# Altium project PCB_8Bit_CPU.PrjPcb
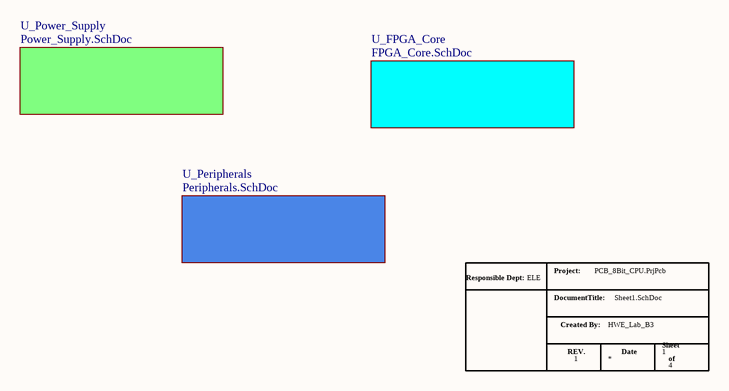
[diagram p0: Sheet1.SchDoc]
4 sheets, 105 parts. Net scope: global (net labels, ports and power ports of the same name join across sheets).
Board file: CPU_Board_Updated.PcbDoc
Sheets:
  Sheet1.SchDoc
    U_Power_Supply = Power_Supply.SchDoc
    U_FPGA_Core = FPGA_Core.SchDoc
    U_Peripherals = Peripherals.SchDoc

## Sheet Sheet1.SchDoc
size A; SheetNumber: 1; SheetTotal: 4

### Parts
(Parts that share a designator on the sheet are numbered #1, #2 ... from top to bottom, then left to right.)
*#1  8Bit_CPU  (value not drawn)  (graphical)

### Sub-sheets
U_FPGA_Core = FPGA_Core.SchDoc: no entries
U_Peripherals = Peripherals.SchDoc: no entries
U_Power_Supply = Power_Supply.SchDoc: no entries

### Notes on the sheet
- (in symbol 8Bit_CPU) Project:; Responsible Dept:; ELE; DocumentTitle:; Created By:; HWE_Lab_B3; Sheet; REV.; Date; 1; of

## Sheet Power_Supply.SchDoc
size A; SheetNumber: 2; SheetTotal: 4
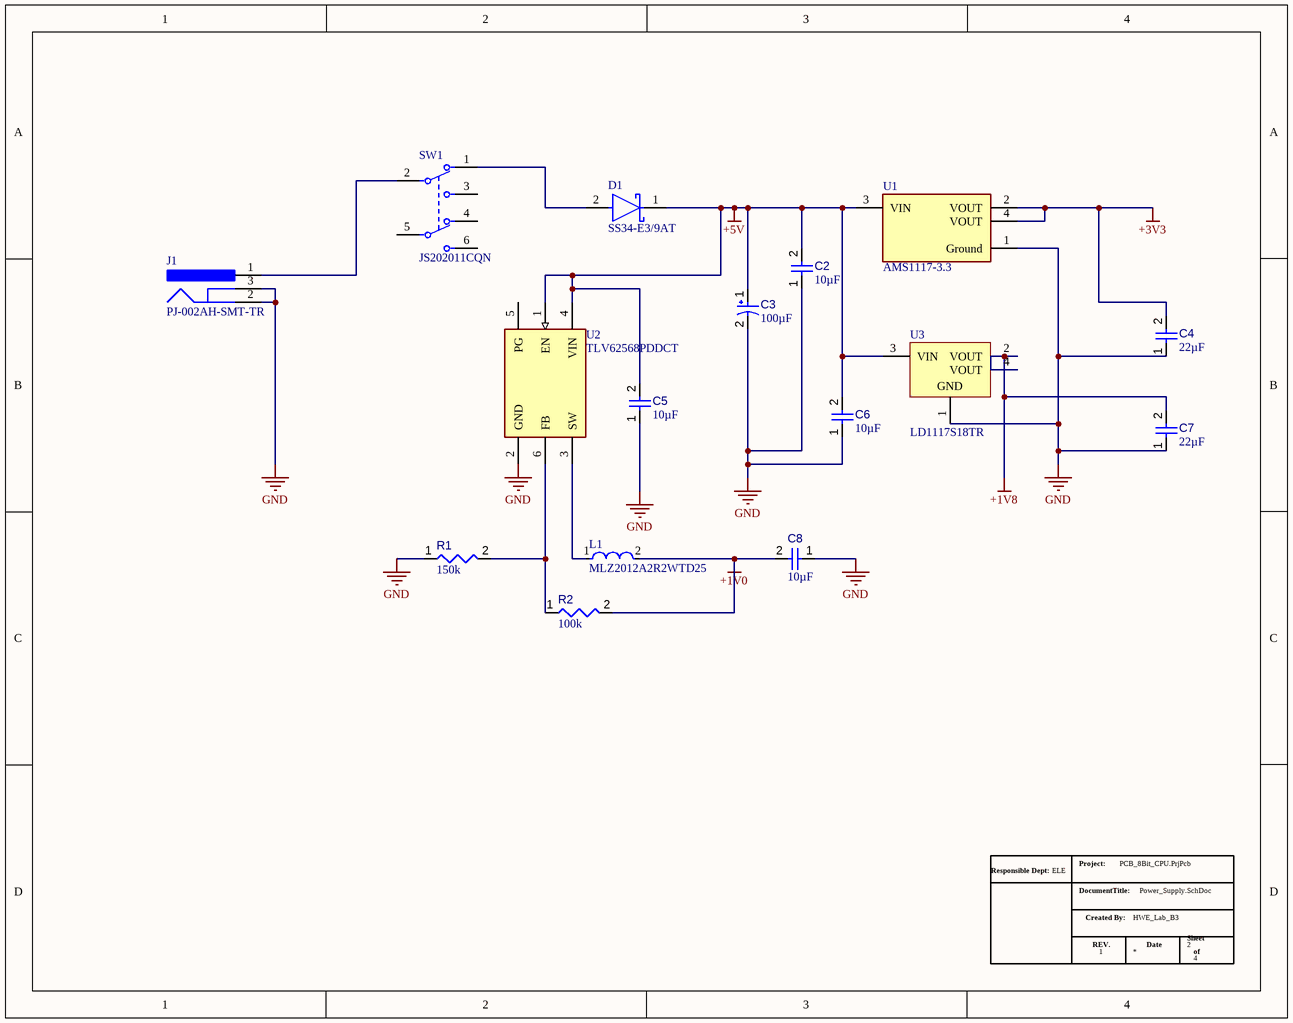
[diagram p1: Power_Supply.SchDoc]

### Parts
(Parts that share a designator on the sheet are numbered #1, #2 ... from top to bottom, then left to right.)
*#2  8Bit_CPU  (value not drawn)  (graphical)
C2  value 10µF  [CAPC0805(2012)145_L]  (hidden comment: Capacitor 10µF +/-20% 25V 0805)
C3  value 100µF  [PNSC-6TPE150MAZB_L]  (hidden comment: Capacitor 6.8µF +/-20% 35V B2)
C4  value 22µF  [CAPC0805(2012)145_L]  (hidden comment: Capacitor 10µF +/-20% 25V 0805)
C5  value 10µF  [CAPC0805(2012)145_L]  (hidden comment: Capacitor 10µF +/-20% 25V 0805)
C6  value 10µF  [CAPC0805(2012)145_L]  (hidden comment: Capacitor 10µF +/-20% 25V 0805)
C7  value 22µF  [CAPC0805(2012)145_L]  (hidden comment: Capacitor 10µF +/-20% 25V 0805)
C8  value 10µF  [CAPC0805(2012)145_L]  (hidden comment: Capacitor 10µF +/-20% 25V 0805)
D1  SS34-E3/9AT  [FP-SMC-MFG]
J1  PJ-002AH-SMT-TR  [CUI-PJ-002AH-4_V]
L1  MLZ2012A2R2WTD25  [FP-MLZ2012-0_85-MFG]
R1  value 150k  [RESC0402(1005)_L]  (hidden comment: Resistor 100K +/-1 % 0402 63 mW)
R2  value 100k  [RESC0402(1005)_L]  (hidden comment: Resistor 100K +/-1 % 0402 63 mW)
SW1  JS202011CQN  [FP-JS202011CQN-MFG]
U1  AMS1117-3.3  [FP-AMS1117-IPC_C]
U2  TLV62568PDDCT  [FP-DDC0006A-MFG]
U3  LD1117S18TR  [SOT-223_M]

### Nets
+1V0: C8.2 L1.2 R2.2
+1V8: C7.2 U3.2(VOUT) U3.4(VOUT)
+3V3: C4.2 U1.2(VOUT) U1.4(VOUT)
+5V: C2.2 C3.1 C5.2 C6.2 D1.1(C) U1.3(VIN) U2.1(EN) U2.4(VIN) U3.3(VIN)
GND: C2.1 C3.2 C4.1 C5.1 C6.1 C7.1 C8.1 J1.2 J1.3 R1.1 U1.1(Ground) U2.2(GND) U3.1(GND)
NetD1_2: D1.2(A) SW1.1
NetJ1_1: J1.1 SW1.2
NetL1_1: L1.1 U2.3(SW)
NetR1_2: R1.2 R2.1 U2.6(FB)

Not connected (* = marked no-connect by the designer): SW1 3 4 5 6; U2 5(PG)

### Notes on the sheet
- (in symbol 8Bit_CPU) Project:; Responsible Dept:; ELE; DocumentTitle:; Created By:; HWE_Lab_B3; Sheet; REV.; Date; 1; of

### Library data of the parts
C2 C4-C8 = CMP-001-00079-4: Chip Capacitor, 10µF +/-20%, 25V, 0805, Thickness 1.45 mm; Tolerance: 10%; Max Operating Temperature: 85°C; Case/Package: 0805; Voltage Rating: 25V; Min Operating Temperature: -55°C; Mounting Technology: SMT; Pins: 2
C3 = CMP-001-00059-3: Molded Tantalum Polymer Capacitor, 6.8 uF, +/- 20%, 35 V, -55 to 105 degC, 2-Pin SMD, RoHS, Tape and Reel; Pins: 2; Voltage Rating: 35V; Case/Package: 1210; Tolerance: 20%; Mounting Technology: SMT; Min Operating Temperature: -55°C; Max Operating Temperature: 105°C
D1 = CMP-02539-000066-1: DIODE SCHOTTKY 40V 3A DO214AB; Peak Non-Repetitive Surge Current: 100A; Forward Voltage: 500mV; Element Configuration: Single; Max Reverse Current: 500uA; Case/Package: SMC; Radiation Hardening: No; Series: -; Max Surge Current: 100A; RoHS Compliant: Yes; Min Operating Temperature: -55°C; Average Rectified Current: 3A; Max Reverse Leakage Current: 500uA; Package Quantity: 3500; Max Reverse Voltage (DC): 40V; Forward Current: 3A; Packaging: Tape and Reel; Max Operating Temperature: 125°C; Max Repetitive Reverse Voltage (Vrrm): 40V; Number of Pins: 2; Mount: Surface Mount
J1 = CMP-2000-06896-2: DC Power Jack, Right Angle, -25 to 85 degC, 4-Pin 14.8 x 9 x 11 mm SMD, RoHS, Tape and Reel; Manufacturer: CUIInc.; Brand: CUI; Inside Contact Diameter: 2mm; Voltage Rating: 24V; Insulation Resistance: 100MOhms; Outside Contact Diameter: 6.5mm; Current Rating: 5A; Mounting Angle: Right; Contact Plating: Nickel; Package Description: 4-Pin Surface Mount Device, Body 14.8 x 9 mm, Pitch 6.1 mm; Factory Pack Quantity: 350; Datasheet Version: Rev. 1.03, 11/2012; Operating Temperature Range: -25Cto+85C; Termination Style: SMD/SMT; Product: Jacks; Contact Gender: Male; Product Category: DCPowerConnectors; RoHS: True; Connector Type: DCPowerJack; Packaging: Reel; Contact Material: Brass; Flammability Rating: UL94V-0; Datasheet URL: http://www.cui.com/product/resource/pj-002ah-smt.pdf; Package Reference: PJ-002AH; Manufacturer URL: http://www.cui.com/; PartNumber: PJ-002AH; Mounting Style: SMD/SMT; Mounting Technology: SurfaceMount; Housing Material: Polyamide(PA)
L1 = CMP-08253-000205-1: Shielded Multilayer Inductor 2.2uH ±20% 650mA 195mΩ AEC-Q200 SMD 0805; Test Frequency: 10MHz; DC Resistance (DCR): 195mR; Core Material: Ferrite; Saturation Current: 210mA; Resistance: 0.26R; Current Rating: 650mA; Case/Package: 0805; Ratings: AEC-Q200; Min Operating Temperature: -55°C; Packaging: Tape and Reel; Width: 1.25mm; RoHS Compliant: Yes; Mount: Surface Mount; Inductance: 2.2uH; Max DC Current: 650mA; Height: 0.85mm; Length: 0.079inch; Weight: 0.000194oz; Height - Seated (Max): 0.041inch; Tolerance: 20%; Package Quantity: 4000; Shielding: Shielded; Case Code (Imperial): 0805; Termination: SMD/SMT; Case Code (Metric): 2012; Max Operating Temperature: 125°C
R1 R2 = CMP-009-00168-3: Chip Resistor, 100 kOhms, +/-1 %, 63 mW, -55 to 155 degC, 0402; Tolerance: 1%; Power: 63mW; Max Operating Temperature: 155°C; Min Operating Temperature: -55°C; Pins: 2; Case/Package: 0402
SW1 = CMP-10038-000022-1: SWITCH SLIDE DPDT 300MA 6V; Contact Resistance: 70mR; Actuator Type: Standard; Actuator Color: Black; Actuator Material: Nylon; Actuator Length: 2mm; Contact Current Rating: 100mA; Electrical Life: 5000Cycles; Illumination Type: Non-Illuminated; Switch Function: On-On; Depth: 3.6mm; Lead Free: Lead Free; Current Rating: 300mA; Throw Configuration: DPDT; REACH SVHC: No SVHC; Flammability Rating: UL94 V-0; Contact Plating: Silver; Max Current Rating: 300mA; Packaging: Bulk; Radiation Hardening: No; Switch Travel: 2mm; Package Quantity: 1; Voltage Rating (DC): 6V; Housing Material: Nylon; Contact Material: Copper Alloy; Min Operating Temperature: -40°C; Max Operating Temperature: 85°C; Termination: PC Pins; Mount: Through Hole; Length: 9mm; Max Voltage Rating (DC): 6V; RoHS Compliant: Yes; Series: JS; Orientation: Vertical
U1 = CMP-209535-000001-1: LDO Voltage Regulators 1A, 3.3V; Manufacturer: Advanced Monolithic Systems; Dropout Voltage: 1.1V; Output Type: Fixed; Nominal Supply Current: 5mA; Max Power Dissipation: 1.2W; Max Supply Voltage: 15V; Number Of Outputs: 1; Standoff Height: 0.64mm; Max Junction Temp: +125°C; Height: 1.8mm; Package: AMS1117; Device Class L2: Power Management ICs; ComponentLink2Description: Datasheet; ComponentLink2URL: http://www.advanced-monolithic.com/pdf/ds1117.pdf; Category: IC; RoHS: TRUE; Automotive: No; Device Class L1: Integrated Circuits (ICs); Output Current: 1A; Device Class L3: Voltage Regulators - Linear; Temperature: -40°C to +125°C; Output Voltage: 3.3V; Manufacturer Part Number: AMS1117-3.3; Temperature Range Low: -40°C; Octopart: https://octopart.com/ams1117-3.3-advanced+monolithic+systems-25899300; Lead Free: Yes; Ipc Land Pattern Name: SOT229P700X180-4; Temperature Range High: +125°C
U2 = CMP-04918-000671-1: IC REG BUCK ADJ 1A TSOT23-6; Min Output Voltage: 600mV; Output Type: Adjustable; Switching Frequency: 1.5MHz; Output Configuration: Positive; Synchronous Rectifier: Yes; Number of Outputs: 1; Max Input Voltage: 5.5V; Min Input Voltage: 2.5V; Max Operating Temperature: 125°C; Packaging: Cut Tape; Min Operating Temperature: -40°C; RoHS Compliant: Yes; Output Current: 1A; Mount: Surface Mount; Case/Package: SOT-23-6; Max Output Voltage: 5.5V
U3 = CMP-0244-00308-1: Fixed Low Drop Positive Voltage Regulator, 1.8V, 4-Pin SOT-223, Tape and Reel; ComponentLink1URL: http://www.st.com; PackageReference: SOT-223; PackageDescription: 4-Pin SOT-223 Package, 6.5 x 3.5 mm Body, 2.3 mm Pitch, 7 mm Lead Span; ComponentLink2URL: http://www.st.com/internet/com/TECHNICAL_RESOURCES/TECHNICAL_LITERATURE/DATASHEET/CD00000544.pdf; ComponentLink2Description: Datasheet; ComponentLink1Description: Manufacturer URL; DatasheetVersion: 1/11/2011; PackageVersion: 2010

## Sheet FPGA_Core.SchDoc
size C; SheetNumber: 3; SheetTotal: 4
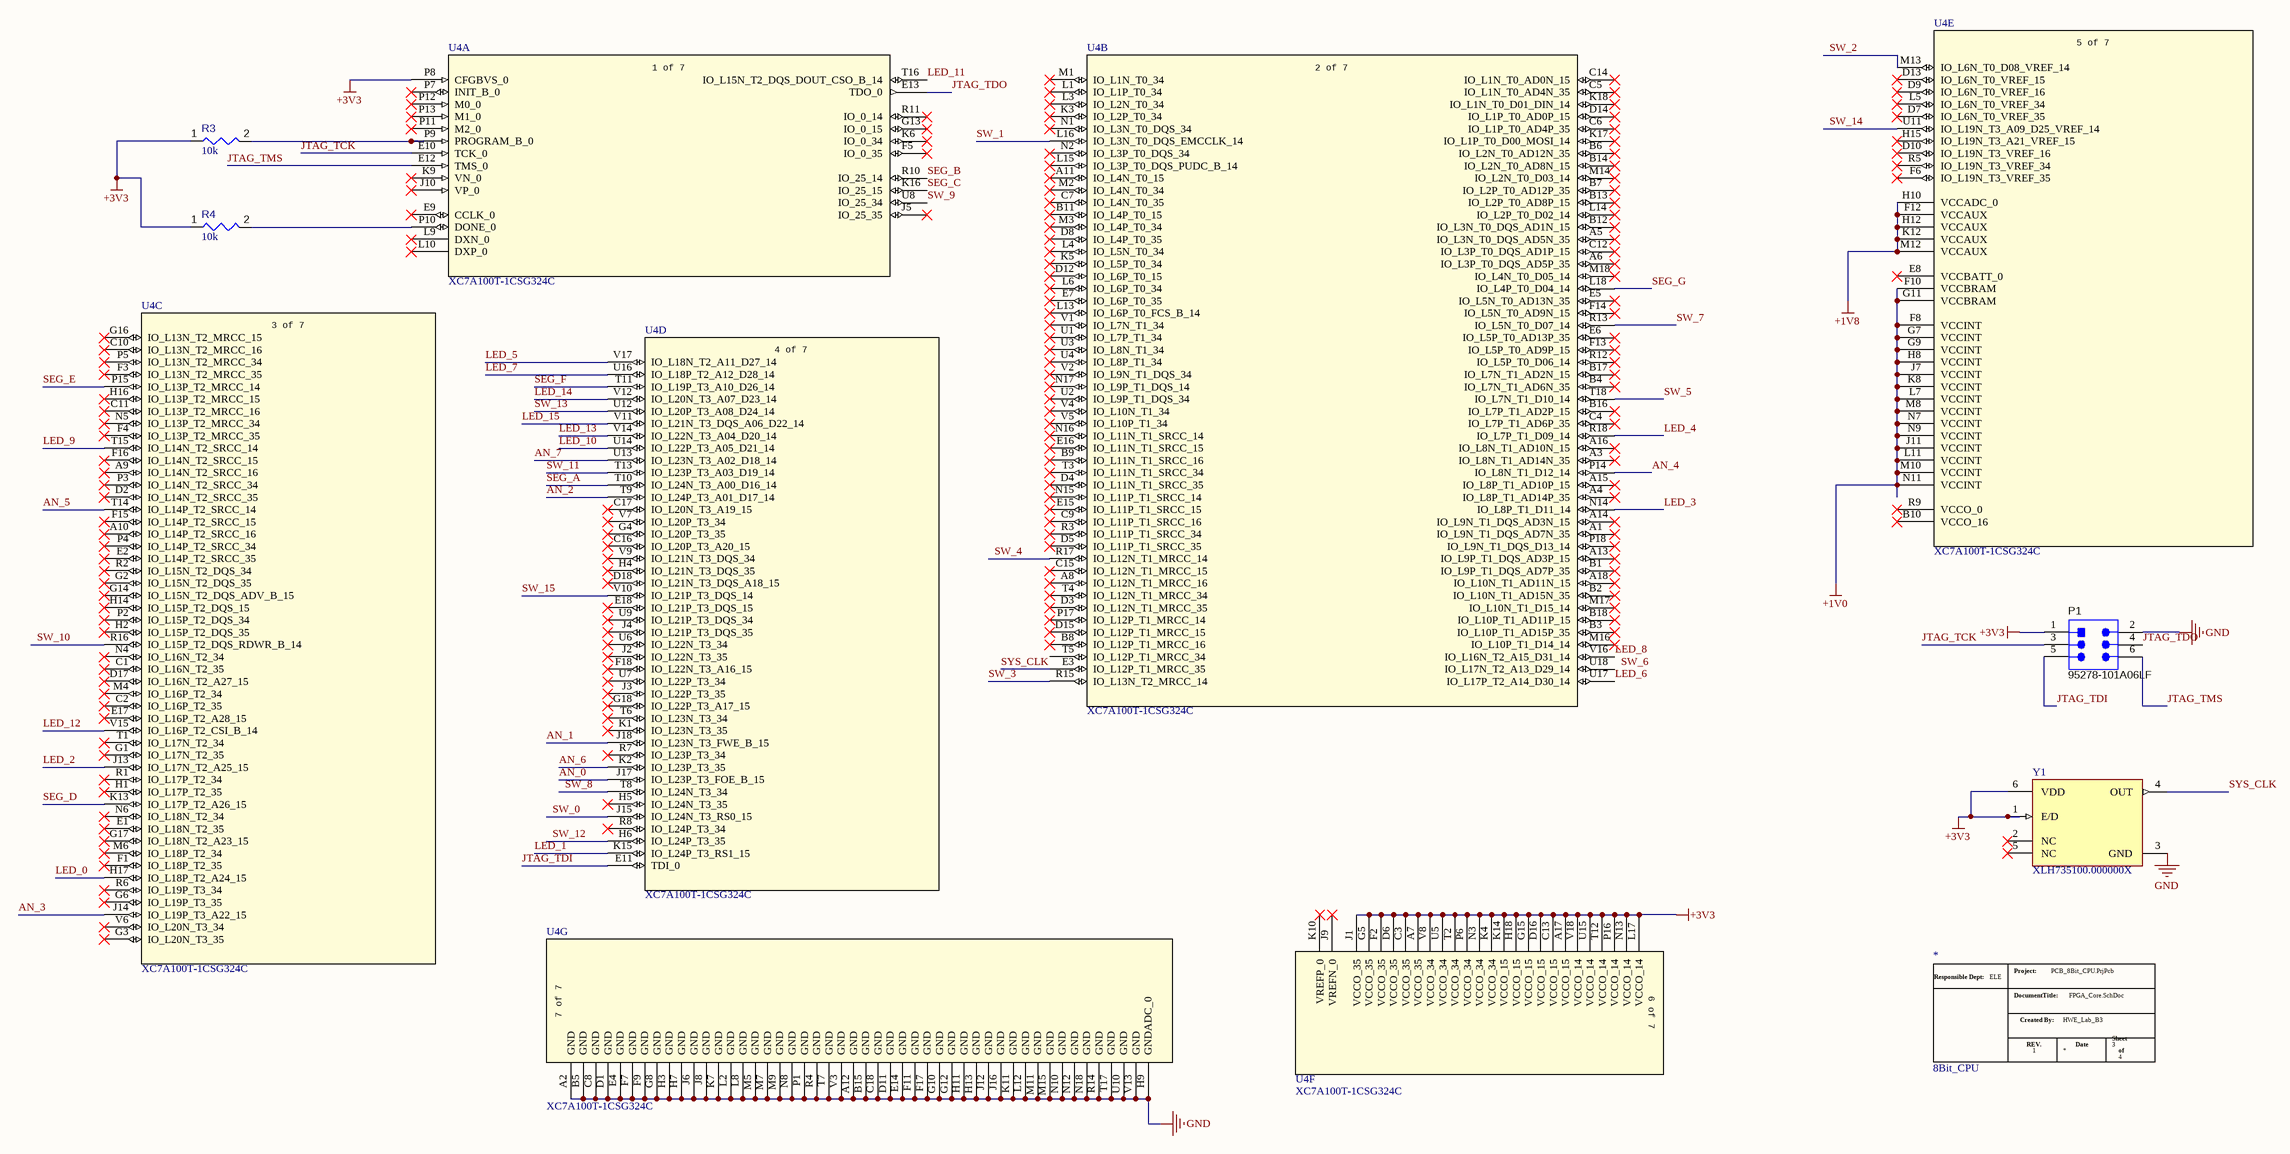
[diagram p2: FPGA_Core.SchDoc]

### Parts
(Parts that share a designator on the sheet are numbered #1, #2 ... from top to bottom, then left to right.)
*#3  8Bit_CPU  (graphical)
P1  95278-101A06LF  [AMPM-95278-101A06LF_V]
R3  value 10k  [RESC0402(1005)_L]  (hidden comment: 10KR2F)
R4  value 10k  [RESC0402(1005)_L]  (hidden comment: 10KR2F)
U4  XC7A100T-1CSG324C  [CSG324_XIL]  (parts A,B,C,D,E,F,G of 7)
Y1  XLH735100.000000X  [JU6_MFG]

### Nets
+1V0: U4.F8(VCCINT) U4.F10(VCCBRAM) U4.G7(VCCINT) U4.G9(VCCINT) U4.G11(VCCBRAM) U4.H8(VCCINT) U4.J7(VCCINT) U4.J11(VCCINT) U4.K8(VCCINT) U4.L7(VCCINT) U4.L11(VCCINT) U4.M8(VCCINT) U4.M10(VCCINT) U4.N7(VCCINT) U4.N9(VCCINT) U4.N11(VCCINT)
+1V8: U4.F12(VCCAUX) U4.H10(VCCADC_0) U4.H12(VCCAUX) U4.K12(VCCAUX) U4.M12(VCCAUX)
+3V3: P1.1 R3.1 R4.1 U4.A7(VCCO_35) U4.A17(VCCO_15) U4.C3(VCCO_35) U4.C13(VCCO_15) U4.D6(VCCO_35) U4.D16(VCCO_15) U4.F2(VCCO_35) U4.G5(VCCO_35) U4.G15(VCCO_15) U4.H18(VCCO_15) U4.J1(VCCO_35) U4.K4(VCCO_34) U4.K14(VCCO_15) U4.L17(VCCO_14) U4.N3(VCCO_34) U4.N13(VCCO_14) U4.P6(VCCO_34) U4.P8(CFGBVS_0) U4.P16(VCCO_14) U4.T2(VCCO_34) U4.T12(VCCO_14) U4.U5(VCCO_34) U4.U15(VCCO_14) U4.V8(VCCO_34) U4.V18(VCCO_14) Y1.1(E/D) Y1.6(VDD)
GND: P1.2 U4.A2(GND) U4.A12(GND) U4.B5(GND) U4.B15(GND) U4.C8(GND) U4.C18(GND) U4.D1(GND) U4.D11(GND) U4.E4(GND) U4.E14(GND) U4.F7(GND) U4.F9(GND) U4.F11(GND) U4.F17(GND) U4.G8(GND) U4.G10(GND) U4.G12(GND) U4.H3(GND) U4.H7(GND) U4.H9(GNDADC_0) U4.H11(GND) U4.H13(GND) U4.J6(GND) U4.J8(GND) U4.J12(GND) U4.J16(GND) U4.K7(GND) U4.K11(GND) U4.L2(GND) U4.L8(GND) U4.L12(GND) U4.M5(GND) U4.M7(GND) U4.M9(GND) U4.M11(GND) U4.M15(GND) U4.N8(GND) U4.N10(GND) U4.N12(GND) U4.N18(GND) U4.P1(GND) U4.R4(GND) U4.R14(GND) U4.T7(GND) U4.T17(GND) U4.U10(GND) U4.V3(GND) U4.V13(GND) Y1.3(GND)
  SW_0: U4.J15(IO_L24N_T3_RS0_15)
  SW_2: U4.M13(IO_L6N_T0_D08_VREF_14)
  SW_4: U4.R17(IO_L12N_T1_MRCC_14)
  SW_6: U4.U18(IO_L17N_T2_A13_D29_14)
  SW_8: U4.T8(IO_L24N_T3_34)
  SW_10: U4.R16(IO_L15P_T2_DQS_RDWR_B_14)
  SW_12: U4.H6(IO_L24P_T3_35)
  SW_14: U4.U11(IO_L19N_T3_A09_D25_VREF_14)
AN_0: U4.J17(IO_L23P_T3_FOE_B_15)
AN_1: U4.J18(IO_L23N_T3_FWE_B_15)
AN_2: U4.T9(IO_L24P_T3_A01_D17_14)
AN_3: U4.J14(IO_L19P_T3_A22_15)
AN_4: U4.P14(IO_L8N_T1_D12_14)
AN_5: U4.T14(IO_L14P_T2_SRCC_14)
AN_6: U4.K2(IO_L23P_T3_35)
AN_7: U4.U13(IO_L23N_T3_A02_D18_14)
JTAG_TCK: P1.3 U4.E10(TCK_0)
JTAG_TDI: P1.5 U4.E11(TDI_0)
JTAG_TDO: P1.4 U4.E13(TDO_0)
JTAG_TMS: P1.6 U4.E12(TMS_0)
LED_0: U4.H17(IO_L18P_T2_A24_15)
LED_1: U4.K15(IO_L24P_T3_RS1_15)
LED_2: U4.J13(IO_L17N_T2_A25_15)
LED_3: U4.N14(IO_L8P_T1_D11_14)
LED_4: U4.R18(IO_L7P_T1_D09_14)
LED_5: U4.V17(IO_L18N_T2_A11_D27_14)
LED_6: U4.U17(IO_L17P_T2_A14_D30_14)
LED_7: U4.U16(IO_L18P_T2_A12_D28_14)
LED_8: U4.V16(IO_L16N_T2_A15_D31_14)
LED_9: U4.T15(IO_L14N_T2_SRCC_14)
LED_10: U4.U14(IO_L22P_T3_A05_D21_14)
LED_11: U4.T16(IO_L15N_T2_DQS_DOUT_CSO_B_14)
LED_12: U4.V15(IO_L16P_T2_CSI_B_14)
LED_13: U4.V14(IO_L22N_T3_A04_D20_14)
LED_14: U4.V12(IO_L20N_T3_A07_D23_14)
LED_15: U4.V11(IO_L21N_T3_DQS_A06_D22_14)
SEG_A: U4.T10(IO_L24N_T3_A00_D16_14)
SEG_B: U4.R10(IO_25_14)
SEG_C: U4.K16(IO_25_15)
SEG_D: U4.K13(IO_L17P_T2_A26_15)
SEG_E: U4.P15(IO_L13P_T2_MRCC_14)
SEG_F: U4.T11(IO_L19P_T3_A10_D26_14)
SEG_G: U4.L18(IO_L4P_T0_D04_14)
SW_1: U4.L16(IO_L3N_T0_DQS_EMCCLK_14)
SW_3: U4.R15(IO_L13N_T2_MRCC_14)
SW_5: U4.T18(IO_L7N_T1_D10_14)
SW_7: U4.R13(IO_L5N_T0_D07_14)
SW_9: U4.U8(IO_25_34)
SW_11: U4.T13(IO_L23P_T3_A03_D19_14)
SW_13: U4.U12(IO_L20P_T3_A08_D24_14)
SW_15: U4.V10(IO_L21P_T3_DQS_14)
SYS_CLK: U4.E3(IO_L12P_T1_MRCC_35) Y1.4(OUT)
NetR3_2: R3.2 U4.P9(PROGRAM_B_0)
NetR4_2: R4.2 U4.P10(DONE_0)

Not connected (* = marked no-connect by the designer): U4 A1(IO_L9N_T1_DQS_AD7N_35)* A3(IO_L8N_T1_AD14N_35)* A4(IO_L8P_T1_AD14P_35)* A5(IO_L3N_T0_DQS_AD5N_35)* A6(IO_L3P_T0_DQS_AD5P_35)* A8(IO_L12N_T1_MRCC_16)* A9(IO_L14N_T2_SRCC_16)* A10(IO_L14P_T2_SRCC_16)* A11(IO_L4N_T0_15)* A13(IO_L9P_T1_DQS_AD3P_15)* A14(IO_L9N_T1_DQS_AD3N_15)* A15(IO_L8P_T1_AD10P_15)* A16(IO_L8N_T1_AD10N_15)* A18(IO_L10N_T1_AD11N_15)* B1(IO_L9P_T1_DQS_AD7P_35)* B2(IO_L10N_T1_AD15N_35)* B3(IO_L10P_T1_AD15P_35)* B4(IO_L7N_T1_AD6N_35)* B6(IO_L2N_T0_AD12N_35)* B7(IO_L2P_T0_AD12P_35)* B8(IO_L12P_T1_MRCC_16)* B9(IO_L11N_T1_SRCC_16)* B10(VCCO_16)* B11(IO_L4P_T0_15)* B12(IO_L3N_T0_DQS_AD1N_15)* B13(IO_L2P_T0_AD8P_15)* B14(IO_L2N_T0_AD8N_15)* B16(IO_L7P_T1_AD2P_15)* B17(IO_L7N_T1_AD2N_15)* B18(IO_L10P_T1_AD11P_15)* C1(IO_L16N_T2_35)* C2(IO_L16P_T2_35)* C4(IO_L7P_T1_AD6P_35)* C5(IO_L1N_T0_AD4N_35)* C6(IO_L1P_T0_AD4P_35)* C7(IO_L4N_T0_35)* C9(IO_L11P_T1_SRCC_16)* C10(IO_L13N_T2_MRCC_16)* C11(IO_L13P_T2_MRCC_16)* C12(IO_L3P_T0_DQS_AD1P_15)* C14(IO_L1N_T0_AD0N_15)* C15(IO_L12N_T1_MRCC_15)* C16(IO_L20P_T3_A20_15)* C17(IO_L20N_T3_A19_15)* D2(IO_L14N_T2_SRCC_35)* D3(IO_L12N_T1_MRCC_35)* D4(IO_L11N_T1_SRCC_35)* D5(IO_L11P_T1_SRCC_35)* D7(IO_L6N_T0_VREF_35)* D8(IO_L4P_T0_35)* D9(IO_L6N_T0_VREF_16)* D10(IO_L19N_T3_VREF_16)* D12(IO_L6P_T0_15)* D13(IO_L6N_T0_VREF_15)* D14(IO_L1P_T0_AD0P_15)* D15(IO_L12P_T1_MRCC_15)* D17(IO_L16N_T2_A27_15)* D18(IO_L21N_T3_DQS_A18_15)* E1(IO_L18N_T2_35)* E2(IO_L14P_T2_SRCC_35)* E5(IO_L5N_T0_AD13N_35)* E6(IO_L5P_T0_AD13P_35)* E7(IO_L6P_T0_35)* E8(VCCBATT_0)* E9(CCLK_0)* E15(IO_L11P_T1_SRCC_15)* E16(IO_L11N_T1_SRCC_15)* E17(IO_L16P_T2_A28_15)* E18(IO_L21P_T3_DQS_15)* F1(IO_L18P_T2_35)* F3(IO_L13N_T2_MRCC_35)* F4(IO_L13P_T2_MRCC_35)* F5(IO_0_35)* F6(IO_L19N_T3_VREF_35)* F13(IO_L5P_T0_AD9P_15)* F14(IO_L5N_T0_AD9N_15)* F15(IO_L14P_T2_SRCC_15)* F16(IO_L14N_T2_SRCC_15)* F18(IO_L22N_T3_A16_15)* G1(IO_L17N_T2_35)* G2(IO_L15N_T2_DQS_35)* G3(IO_L20N_T3_35)* G4(IO_L20P_T3_35)* G6(IO_L19P_T3_35)* G13(IO_0_15)* G14(IO_L15N_T2_DQS_ADV_B_15)* G16(IO_L13N_T2_MRCC_15)* G17(IO_L18N_T2_A23_15)* G18(IO_L22P_T3_A17_15)* H1(IO_L17P_T2_35)* H2(IO_L15P_T2_DQS_35)* H4(IO_L21N_T3_DQS_35)* H5(IO_L24N_T3_35)* H14(IO_L15P_T2_DQS_15)* H15(IO_L19N_T3_A21_VREF_15)* H16(IO_L13P_T2_MRCC_15)* J2(IO_L22N_T3_35)* J3(IO_L22P_T3_35)* J4(IO_L21P_T3_DQS_35)* J5(IO_25_35)* J9(VREFN_0)* J10(VP_0)* K1(IO_L23N_T3_35)* K3(IO_L2P_T0_34)* K5(IO_L5P_T0_34)* K6(IO_0_34)* K9(VN_0)* K10(VREFP_0)* K17(IO_L1P_T0_D00_MOSI_14)* K18(IO_L1N_T0_D01_DIN_14)* L1(IO_L1P_T0_34)* L3(IO_L2N_T0_34)* L4(IO_L5N_T0_34)* L5(IO_L6N_T0_VREF_34)* L6(IO_L6P_T0_34)* L9(DXN_0)* L10(DXP_0)* L13(IO_L6P_T0_FCS_B_14)* L14(IO_L2P_T0_D02_14)* L15(IO_L3P_T0_DQS_PUDC_B_14)* M1(IO_L1N_T0_34)* M2(IO_L4N_T0_34)* M3(IO_L4P_T0_34)* M4(IO_L16P_T2_34)* M6(IO_L18P_T2_34)* M14(IO_L2N_T0_D03_14)* M16(IO_L10P_T1_D14_14)* M17(IO_L10N_T1_D15_14)* M18(IO_L4N_T0_D05_14)* N1(IO_L3N_T0_DQS_34)* N2(IO_L3P_T0_DQS_34)* N4(IO_L16N_T2_34)* N5(IO_L13P_T2_MRCC_34)* N6(IO_L18N_T2_34)* N15(IO_L11P_T1_SRCC_14)* N16(IO_L11N_T1_SRCC_14)* N17(IO_L9P_T1_DQS_14)* P2(IO_L15P_T2_DQS_34)* P3(IO_L14N_T2_SRCC_34)* P4(IO_L14P_T2_SRCC_34)* P5(IO_L13N_T2_MRCC_34)* P7(INIT_B_0)* P11(M2_0)* P12(M0_0)* P13(M1_0)* P17(IO_L12P_T1_MRCC_14)* P18(IO_L9N_T1_DQS_D13_14)* R1(IO_L17P_T2_34)* R2(IO_L15N_T2_DQS_34)* R3(IO_L11P_T1_SRCC_34)* R5(IO_L19N_T3_VREF_34)* R6(IO_L19P_T3_34)* R7(IO_L23P_T3_34)* R8(IO_L24P_T3_34)* R9(VCCO_0)* R11(IO_0_14)* R12(IO_L5P_T0_D06_14)* T1(IO_L17N_T2_34)* T3(IO_L11N_T1_SRCC_34)* T4(IO_L12N_T1_MRCC_34)* T5(IO_L12P_T1_MRCC_34) T6(IO_L23N_T3_34)* U1(IO_L7P_T1_34)* U2(IO_L9P_T1_DQS_34)* U3(IO_L8N_T1_34)* U4(IO_L8P_T1_34)* U6(IO_L22N_T3_34)* U7(IO_L22P_T3_34)* U9(IO_L21P_T3_DQS_34)* V1(IO_L7N_T1_34)* V2(IO_L9N_T1_DQS_34)* V4(IO_L10N_T1_34)* V5(IO_L10P_T1_34)* V6(IO_L20N_T3_34)* V7(IO_L20P_T3_34)* V9(IO_L21N_T3_DQS_34)*; Y1 2(NC)* 5(NC)*

### Notes on the sheet
- (in symbol 8Bit_CPU) Project:; Responsible Dept:; ELE; DocumentTitle:; Created By:; HWE_Lab_B3; Sheet; REV.; Date; 1; of
- (in symbol XC7A100T-1CSG324C, part A) 1 of 7
- (in symbol XC7A100T-1CSG324C, part B) 2 of 7
- (in symbol XC7A100T-1CSG324C, part C) 3 of 7
- (in symbol XC7A100T-1CSG324C, part D) 4 of 7
- (in symbol XC7A100T-1CSG324C, part E) 5 of 7
- (in symbol XC7A100T-1CSG324C, part F) 6 of 7
- (in symbol XC7A100T-1CSG324C, part G) 7 of 7

### Library data of the parts
P1 = CMP-002-00024-2: Male Header, Pitch 2.54 mm, 2 x 3 Position, Height 14.4 mm, RoHS, Tape and Reel; Manufacturer: Amphenol; Package Reference: 95278-101A06LF; Package Description: Male Header, Pitch 2.54 mm, 2 x 3 Position, Height 14.4 mm; RoHS Compliant: Unknown; Case/Package: 95278-101A06LF; Connector Type: Header; Mounting Technology: SM; Gender: Male; Datasheet URL: http://portal.fciconnect.com/Comergent//fci/drawing/95278.pdf; Datasheet Version: Rev. AC, 03/2016
R3 R4 = CMP-009-00066-2: 10K 0.063W 1% 0402 (1005 Metric)  SMD; Power: 63mW; Case/Package: 0402; Mounting Technology: SMT; Pins: 2; Tolerance: 1%
U4 = XC7A100T-1CSG324C: Description; Manufacturer_Name: Xilinx Inc; Copyright: Copyright (C) 2025 Ultra Librarian. All rights reserved.; Manufacturer_Part_Number: XC7A100T-1CSG324C; RefDes: RefDes; Type: Type
Y1 = CMP-00572-106941302-3: Crystal ROHS3Compliant Enable/Disable Active Oscillator -20C~70C 47mA 0.055 1.40mm 100MHz; Max Output Frequency: 999.9MHz; Min Input Voltage: 3.135V; Output Type: LVCMOS; Max Input Voltage: 3.465V; ComponentLink1Description: Manufacturer's Website; ComponentLink2URL: https://octopart.com/cad-content/api/get-model-datasheet/15189/106941302; Case/Package: CLCC; Number of Pins: 6; Mount: Surface Mount; ComponentLink2Description: Datasheet URL; Min Operating Temperature: -20°C; HelpURL: https://octopart.com/cad-content/api/get-model-datasheet/15189/106941302; ComponentLink3Description: Manufacturer's Package Drawing; RoHS: Compliant; ComponentLink3URL: https://www.renesas.com/en/document/psc/ju6-package-outline-70-x-50-mm-body-13-mm-thick; Height: 1.45mm; Max Operating Temperature: 70°C; ComponentLink1URL: http://www.renesas.com

## Sheet Peripherals.SchDoc
size C; SheetNumber: 4; SheetTotal: 4
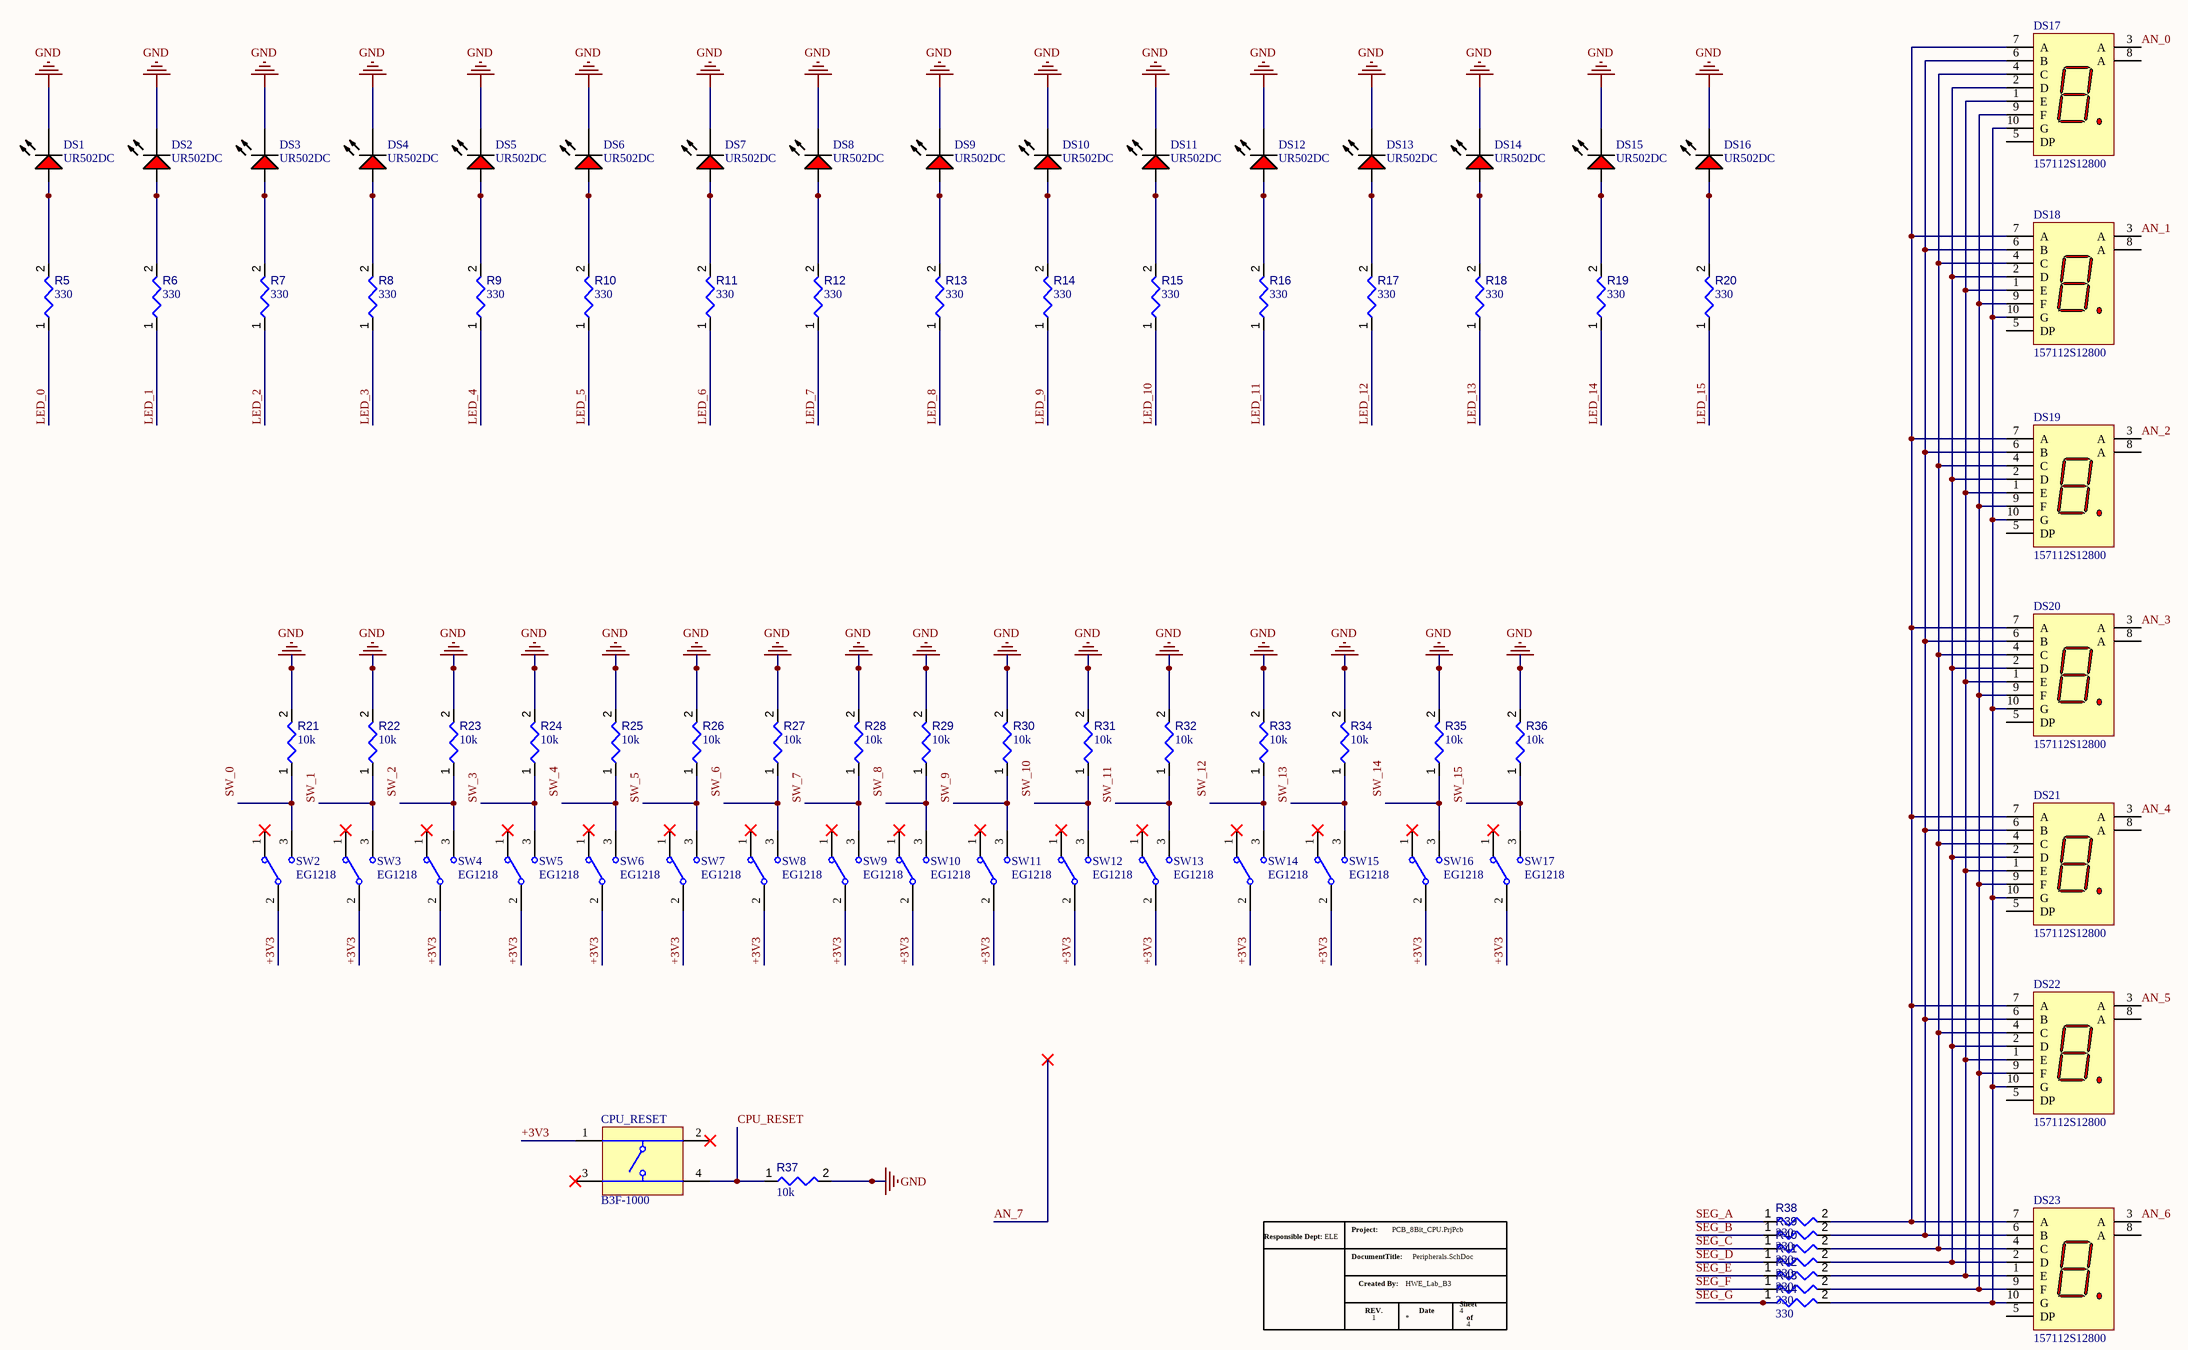
[diagram p3: Peripherals.SchDoc]

### Parts
(Parts that share a designator on the sheet are numbered #1, #2 ... from top to bottom, then left to right.)
*#4  8Bit_CPU  (value not drawn)  (graphical)
CPU_RESET  B3F-1000  [OMRON-B3F-1000-4_V]
DS1  UR502DC  [CGX-UR502DC]
DS2  UR502DC  [CGX-UR502DC]
DS3  UR502DC  [CGX-UR502DC]
DS4  UR502DC  [CGX-UR502DC]
DS5  UR502DC  [CGX-UR502DC]
DS6  UR502DC  [CGX-UR502DC]
DS7  UR502DC  [CGX-UR502DC]
DS8  UR502DC  [CGX-UR502DC]
DS9  UR502DC  [CGX-UR502DC]
DS10  UR502DC  [CGX-UR502DC]
DS11  UR502DC  [CGX-UR502DC]
DS12  UR502DC  [CGX-UR502DC]
DS13  UR502DC  [CGX-UR502DC]
DS14  UR502DC  [CGX-UR502DC]
DS15  UR502DC  [CGX-UR502DC]
DS16  UR502DC  [CGX-UR502DC]
DS17  157112S12800  [WL-S7DS_L12W7.3H3.75]
DS18  157112S12800  [WL-S7DS_L12W7.3H3.75]
DS19  157112S12800  [WL-S7DS_L12W7.3H3.75]
DS20  157112S12800  [WL-S7DS_L12W7.3H3.75]
DS21  157112S12800  [WL-S7DS_L12W7.3H3.75]
DS22  157112S12800  [WL-S7DS_L12W7.3H3.75]
DS23  157112S12800  [WL-S7DS_L12W7.3H3.75]
R5  value 330  [RESC0402(1005)_L]  (hidden comment: Resistor 330R +/-5 % 0402 63 mW)
R6  value 330  [RESC0402(1005)_L]  (hidden comment: Resistor 330R +/-5 % 0402 63 mW)
R7  value 330  [RESC0402(1005)_L]  (hidden comment: Resistor 330R +/-5 % 0402 63 mW)
R8  value 330  [RESC0402(1005)_L]  (hidden comment: Resistor 330R +/-5 % 0402 63 mW)
R9  value 330  [RESC0402(1005)_L]  (hidden comment: Resistor 330R +/-5 % 0402 63 mW)
R10  value 330  [RESC0402(1005)_L]  (hidden comment: Resistor 330R +/-5 % 0402 63 mW)
R11  value 330  [RESC0402(1005)_L]  (hidden comment: Resistor 330R +/-5 % 0402 63 mW)
R12  value 330  [RESC0402(1005)_L]  (hidden comment: Resistor 330R +/-5 % 0402 63 mW)
R13  value 330  [RESC0402(1005)_L]  (hidden comment: Resistor 330R +/-5 % 0402 63 mW)
R14  value 330  [RESC0402(1005)_L]  (hidden comment: Resistor 330R +/-5 % 0402 63 mW)
R15  value 330  [RESC0402(1005)_L]  (hidden comment: Resistor 330R +/-5 % 0402 63 mW)
R16  value 330  [RESC0402(1005)_L]  (hidden comment: Resistor 330R +/-5 % 0402 63 mW)
R17  value 330  [RESC0402(1005)_L]  (hidden comment: Resistor 330R +/-5 % 0402 63 mW)
R18  value 330  [RESC0402(1005)_L]  (hidden comment: Resistor 330R +/-5 % 0402 63 mW)
R19  value 330  [RESC0402(1005)_L]  (hidden comment: Resistor 330R +/-5 % 0402 63 mW)
R20  value 330  [RESC0402(1005)_L]  (hidden comment: Resistor 330R +/-5 % 0402 63 mW)
R21  value 10k  [RESC0402(1005)_L]  (hidden comment: 10KR2F)
R22  value 10k  [RESC0402(1005)_L]  (hidden comment: 10KR2F)
R23  value 10k  [RESC0402(1005)_L]  (hidden comment: 10KR2F)
R24  value 10k  [RESC0402(1005)_L]  (hidden comment: 10KR2F)
R25  value 10k  [RESC0402(1005)_L]  (hidden comment: 10KR2F)
R26  value 10k  [RESC0402(1005)_L]  (hidden comment: 10KR2F)
R27  value 10k  [RESC0402(1005)_L]  (hidden comment: 10KR2F)
R28  value 10k  [RESC0402(1005)_L]  (hidden comment: 10KR2F)
R29  value 10k  [RESC0402(1005)_L]  (hidden comment: 10KR2F)
R30  value 10k  [RESC0402(1005)_L]  (hidden comment: 10KR2F)
R31  value 10k  [RESC0402(1005)_L]  (hidden comment: 10KR2F)
R32  value 10k  [RESC0402(1005)_L]  (hidden comment: 10KR2F)
R33  value 10k  [RESC0402(1005)_L]  (hidden comment: 10KR2F)
R34  value 10k  [RESC0402(1005)_L]  (hidden comment: 10KR2F)
R35  value 10k  [RESC0402(1005)_L]  (hidden comment: 10KR2F)
R36  value 10k  [RESC0402(1005)_L]  (hidden comment: 10KR2F)
R37  value 10k  [RESC0402(1005)_L]  (hidden comment: 10KR2F)
R38  value 330  [RESC0402(1005)_L]  (hidden comment: Resistor 330R +/-5 % 0402 63 mW)
R39  value 330  [RESC0402(1005)_L]  (hidden comment: Resistor 330R +/-5 % 0402 63 mW)
R40  value 330  [RESC0402(1005)_L]  (hidden comment: Resistor 330R +/-5 % 0402 63 mW)
R41  value 330  [RESC0402(1005)_L]  (hidden comment: Resistor 330R +/-5 % 0402 63 mW)
R42  value 330  [RESC0402(1005)_L]  (hidden comment: Resistor 330R +/-5 % 0402 63 mW)
R43  value 330  [RESC0402(1005)_L]  (hidden comment: Resistor 330R +/-5 % 0402 63 mW)
R44  value 330  [RESC0402(1005)_L]  (hidden comment: Resistor 330R +/-5 % 0402 63 mW)
SW2  EG1218  [ESWI-EG1218_V]
SW3  EG1218  [ESWI-EG1218_V]
SW4  EG1218  [ESWI-EG1218_V]
SW5  EG1218  [ESWI-EG1218_V]
SW6  EG1218  [ESWI-EG1218_V]
SW7  EG1218  [ESWI-EG1218_V]
SW8  EG1218  [ESWI-EG1218_V]
SW9  EG1218  [ESWI-EG1218_V]
SW10  EG1218  [ESWI-EG1218_V]
SW11  EG1218  [ESWI-EG1218_V]
SW12  EG1218  [ESWI-EG1218_V]
SW13  EG1218  [ESWI-EG1218_V]
SW14  EG1218  [ESWI-EG1218_V]
SW15  EG1218  [ESWI-EG1218_V]
SW16  EG1218  [ESWI-EG1218_V]
SW17  EG1218  [ESWI-EG1218_V]

### Nets
+3V3: CPU_RESET.1 SW2.2(COM) SW3.2(COM) SW4.2(COM) SW5.2(COM) SW6.2(COM) SW7.2(COM) SW8.2(COM) SW9.2(COM) SW10.2(COM) SW11.2(COM) SW12.2(COM) SW13.2(COM) SW14.2(COM) SW15.2(COM) SW16.2(COM) SW17.2(COM)
GND: DS1.2(K) DS2.2(K) DS3.2(K) DS4.2(K) DS5.2(K) DS6.2(K) DS7.2(K) DS8.2(K) DS9.2(K) DS10.2(K) DS11.2(K) DS12.2(K) DS13.2(K) DS14.2(K) DS15.2(K) DS16.2(K) R21.2 R22.2 R23.2 R24.2 R25.2 R26.2 R27.2 R28.2 R29.2 R30.2 R31.2 R32.2 R33.2 R34.2 R35.2 R36.2 R37.2
  SW_0: R21.1 SW2.3
  SW_2: R23.1 SW4.3
  SW_4: R25.1 SW6.3
  SW_6: R27.1 SW8.3
  SW_8: R29.1 SW10.3
  SW_10: R31.1 SW12.3
  SW_12: R33.1 SW14.3
  SW_14: R35.1 SW16.3
AN_0: DS17.3(A)
AN_1: DS18.3(A)
AN_2: DS19.3(A)
AN_3: DS20.3(A)
AN_4: DS21.3(A)
AN_5: DS22.3(A)
AN_6: DS23.3(A)
CPU_RESET: CPU_RESET.4 R37.1
LED_0: R5.1
LED_1: R6.1
LED_2: R7.1
LED_3: R8.1
LED_4: R9.1
LED_5: R10.1
LED_6: R11.1
LED_7: R12.1
LED_8: R13.1
LED_9: R14.1
LED_10: R15.1
LED_11: R16.1
LED_12: R17.1
LED_13: R18.1
LED_14: R19.1
LED_15: R20.1
SEG_A: R38.1
SEG_B: R39.1
SEG_C: R40.1
SEG_D: R41.1
SEG_E: R42.1
SEG_F: R43.1
SEG_G: R44.1
SW_1: R22.1 SW3.3
SW_3: R24.1 SW5.3
SW_5: R26.1 SW7.3
SW_7: R28.1 SW9.3
SW_9: R30.1 SW11.3
SW_11: R32.1 SW13.3
SW_13: R34.1 SW15.3
SW_15: R36.1 SW17.3
NetDS1_1: DS1.1(A) R5.2
NetDS2_1: DS2.1(A) R6.2
NetDS3_1: DS3.1(A) R7.2
NetDS4_1: DS4.1(A) R8.2
NetDS5_1: DS5.1(A) R9.2
NetDS6_1: DS6.1(A) R10.2
NetDS7_1: DS7.1(A) R11.2
NetDS8_1: DS8.1(A) R12.2
NetDS9_1: DS9.1(A) R13.2
NetDS10_1: DS10.1(A) R14.2
NetDS11_1: DS11.1(A) R15.2
NetDS12_1: DS12.1(A) R16.2
NetDS13_1: DS13.1(A) R17.2
NetDS14_1: DS14.1(A) R18.2
NetDS15_1: DS15.1(A) R19.2
NetDS16_1: DS16.1(A) R20.2
NetDS17_1: DS17.1(E) DS18.1(E) DS19.1(E) DS20.1(E) DS21.1(E) DS22.1(E) DS23.1(E) R42.2
NetDS17_2: DS17.2(D) DS18.2(D) DS19.2(D) DS20.2(D) DS21.2(D) DS22.2(D) DS23.2(D) R41.2
NetDS17_4: DS17.4(C) DS18.4(C) DS19.4(C) DS20.4(C) DS21.4(C) DS22.4(C) DS23.4(C) R40.2
NetDS17_6: DS17.6(B) DS18.6(B) DS19.6(B) DS20.6(B) DS21.6(B) DS22.6(B) DS23.6(B) R39.2
NetDS17_7: DS17.7(A) DS18.7(A) DS19.7(A) DS20.7(A) DS21.7(A) DS22.7(A) DS23.7(A) R38.2
NetDS17_9: DS17.9(F) DS18.9(F) DS19.9(F) DS20.9(F) DS21.9(F) DS22.9(F) DS23.9(F) R43.2
NetDS17_10: DS17.10(G) DS18.10(G) DS19.10(G) DS20.10(G) DS21.10(G) DS22.10(G) DS23.10(G) R44.2

Not connected (* = marked no-connect by the designer): CPU_RESET 2* 3*; DS17 5(DP) 8(A); DS18 5(DP) 8(A); DS19 5(DP) 8(A); DS20 5(DP) 8(A); DS21 5(DP) 8(A); DS22 5(DP) 8(A); DS23 5(DP) 8(A); SW2 1*; SW3 1*; SW4 1*; SW5 1*; SW6 1*; SW7 1*; SW8 1*; SW9 1*; SW10 1*; SW11 1*; SW12 1*; SW13 1*; SW14 1*; SW15 1*; SW16 1*; SW17 1*

### Notes on the sheet
- (in symbol 8Bit_CPU) Project:; Responsible Dept:; ELE; DocumentTitle:; Created By:; HWE_Lab_B3; Sheet; REV.; Date; 1; of

### Library data of the parts
CPU_RESET = CMP-1677-00002-1: Tactile Switch, SPST-NO, 0.05 A, 5 to 24 V, -25 to 70 degC, 4-Pin THD, RoHS, Bulk; Shielding: Shielded; Gender: Female; Capacitance: -45 f; Voltage Rating: 150 V; Current Rating: 1.5 A; Radiation Hardening: No; Contact Plating: Gold; Height: 14.99 mm; Min Operating Temperature: -40 degC; Packaging: Tray; ComponentLink2Description: Datasheet; ComponentLink1URL: http://www.omron.com/; Lead Pitch: 1.27 mm; RoHSCompliant: true; Pins: 8; PackageReference: B3F-1000; Width: 25.4 mm; Contact Material: Brass; ComponentLink2URL: http://www.omron.com/ecb/products/pdf/en-b3f.pdf; PackageDescription: 4-Pin Through Hole Device, Body 6 x 6 mm; DatasheetVersion: Jan-15; ComponentLink1Description: Manufacturer URL; Package Quantity: 1080; Mount: Through Hole; Length: 18.34 mm; Max Operating Temperature: 70 degC
DS1-DS16 = CMP-007-00009-2: Red LED, 80 mW, 30 mA, -25 to 85 degC, 2-Pin THD; Manufacturer: Shenzhen CGX; Power: 80mW; Case/Package: UR502DC; RoHS Compliant: Unknown; Package Description: 2-Pin Through Hole Device, Dia 5.9 mm, Height 9.1 mm; Manufacturer URL: http://szcgx.com/; Datasheet Version: Sep-14; Package Reference: UR502DC; Datasheet URL: http://datasheet.octopart.com/UR502DC-Chengguangxing-datasheet-62330342.pdf; Mounting Technology: TH
DS17-DS23 = CMP-03913-119893987-3: 7-Seg Display, Comm Anode, Super Red Rohs Compliant: Yes; Forward Voltage: 2V; Dominant Wavelength: 635nm; Forward Current: 100mA; Luminous Intensity: 15mcd; Max Reverse Voltage (DC): 5V; Height: 3.75mm; Width: 7.3mm; Max Operating Temperature: 85°C; Length: 12mm; RoHS: Compliant; Min Operating Temperature: -35°C
R5-R20 R38-R44 = CMP-009-00132-3: Chip Resistor, 330 Ohms, +/-5 %, 63 mW, -55 to 155 degC, 0402; Power: 63mW; Tolerance: 5%; Pins: 2; Max Operating Temperature: 155°C; Min Operating Temperature: -55°C; Case/Package: 0402
R21-R37 = CMP-009-00066-2: as R3 on sheet FPGA_Core; Case/Package: 0402; Mounting Technology: SMT; Pins: 2; Tolerance: 1%
SW2-SW17 = CMP-011-00006-2: Slide Switch, SPDT, 500 V, -20 to 70 degC, 3-Pin THD, RoHS, Bulk; Manufacturer: E-Switch; Voltage Rating (DC): 30V; Current Rating: 200mA; Operating Force: 250gf; Package Quantity: 1000; Contact Plating: Silver; Max Operating Temperature: 70°C; Min Operating Temperature: -20°C; Contact Material: Copper; Datasheet URL: https://www.e-switch.com/system/asset/product_line/data_sheet/119/EG.pdf; Contact Finish: Silver; Case/Package: EG1218; Voltage Rating (AC): 30V; Datasheet Version: Oct-15; Package Description: 3-Pin Through Hole Device, Body 11.6 x 4 mm, Pitch 2.5 mm; RoHS Compliant: True; Package Reference: EG1218; Manufacturer URL: http://www.e-switch.ch/en/; Throw Configuration: SPDT; Contact Current Rating: 200mA; Mounting Technology: TH; Packaging: Bulk; Pins: 3

## Nets that join several sheets
+1V0: Power_Supply (C8.2 L1.2 R2.2), FPGA_Core (16 pins)
+1V8: Power_Supply (C7.2 U3.2 U3.4), FPGA_Core (5 pins)
+3V3: Power_Supply (C4.2 U1.2 U1.4), FPGA_Core (30 pins), Peripherals (17 pins)
GND: Power_Supply (13 pins), FPGA_Core (50 pins), Peripherals (33 pins)
  SW_0: FPGA_Core (U4.J15), Peripherals (R21.1 SW2.3)
  SW_2: FPGA_Core (U4.M13), Peripherals (R23.1 SW4.3)
  SW_4: FPGA_Core (U4.R17), Peripherals (R25.1 SW6.3)
  SW_6: FPGA_Core (U4.U18), Peripherals (R27.1 SW8.3)
  SW_8: FPGA_Core (U4.T8), Peripherals (R29.1 SW10.3)
  SW_10: FPGA_Core (U4.R16), Peripherals (R31.1 SW12.3)
  SW_12: FPGA_Core (U4.H6), Peripherals (R33.1 SW14.3)
  SW_14: FPGA_Core (U4.U11), Peripherals (R35.1 SW16.3)
AN_0: FPGA_Core (U4.J17), Peripherals (DS17.3)
AN_1: FPGA_Core (U4.J18), Peripherals (DS18.3)
AN_2: FPGA_Core (U4.T9), Peripherals (DS19.3)
AN_3: FPGA_Core (U4.J14), Peripherals (DS20.3)
AN_4: FPGA_Core (U4.P14), Peripherals (DS21.3)
AN_5: FPGA_Core (U4.T14), Peripherals (DS22.3)
AN_6: FPGA_Core (U4.K2), Peripherals (DS23.3)
LED_0: FPGA_Core (U4.H17), Peripherals (R5.1)
LED_1: FPGA_Core (U4.K15), Peripherals (R6.1)
LED_2: FPGA_Core (U4.J13), Peripherals (R7.1)
LED_3: FPGA_Core (U4.N14), Peripherals (R8.1)
LED_4: FPGA_Core (U4.R18), Peripherals (R9.1)
LED_5: FPGA_Core (U4.V17), Peripherals (R10.1)
LED_6: FPGA_Core (U4.U17), Peripherals (R11.1)
LED_7: FPGA_Core (U4.U16), Peripherals (R12.1)
LED_8: FPGA_Core (U4.V16), Peripherals (R13.1)
LED_9: FPGA_Core (U4.T15), Peripherals (R14.1)
LED_10: FPGA_Core (U4.U14), Peripherals (R15.1)
LED_11: FPGA_Core (U4.T16), Peripherals (R16.1)
LED_12: FPGA_Core (U4.V15), Peripherals (R17.1)
LED_13: FPGA_Core (U4.V14), Peripherals (R18.1)
LED_14: FPGA_Core (U4.V12), Peripherals (R19.1)
LED_15: FPGA_Core (U4.V11), Peripherals (R20.1)
SEG_A: FPGA_Core (U4.T10), Peripherals (R38.1)
SEG_B: FPGA_Core (U4.R10), Peripherals (R39.1)
SEG_C: FPGA_Core (U4.K16), Peripherals (R40.1)
SEG_D: FPGA_Core (U4.K13), Peripherals (R41.1)
SEG_E: FPGA_Core (U4.P15), Peripherals (R42.1)
SEG_F: FPGA_Core (U4.T11), Peripherals (R43.1)
SEG_G: FPGA_Core (U4.L18), Peripherals (R44.1)
SW_1: FPGA_Core (U4.L16), Peripherals (R22.1 SW3.3)
SW_3: FPGA_Core (U4.R15), Peripherals (R24.1 SW5.3)
SW_5: FPGA_Core (U4.T18), Peripherals (R26.1 SW7.3)
SW_7: FPGA_Core (U4.R13), Peripherals (R28.1 SW9.3)
SW_9: FPGA_Core (U4.U8), Peripherals (R30.1 SW11.3)
SW_11: FPGA_Core (U4.T13), Peripherals (R32.1 SW13.3)
SW_13: FPGA_Core (U4.U12), Peripherals (R34.1 SW15.3)
SW_15: FPGA_Core (U4.V10), Peripherals (R36.1 SW17.3)